# Altium schematic sheet 03_SHIELD_SLOT_A.SchDoc: Slot A for Lophilo Shield
size 381 x 266 mm; Organization: Meteroi; Address1: Room 428, 410 Guiping Rd.; Address2: Shanghai 200233, CHINA; SheetNumber: 3; SheetTotal: 9; PageSetup: Record=PageOptions|CenterHorizontal=True|CenterVertical=True|PrintScale=0.75|XCorrection=1.00|YCorrection=1.00|PrintKind=2|BorderSize=5000000|LeftOffset=0|BottomOffset=0|Orientation=2|PaperLength=1000|PaperWidth=1000|Scale=100|PaperSource=276|PrintQuality=-3|MediaType=1|DitherType=10|PaperKind=A4|PrintScaleMode=1
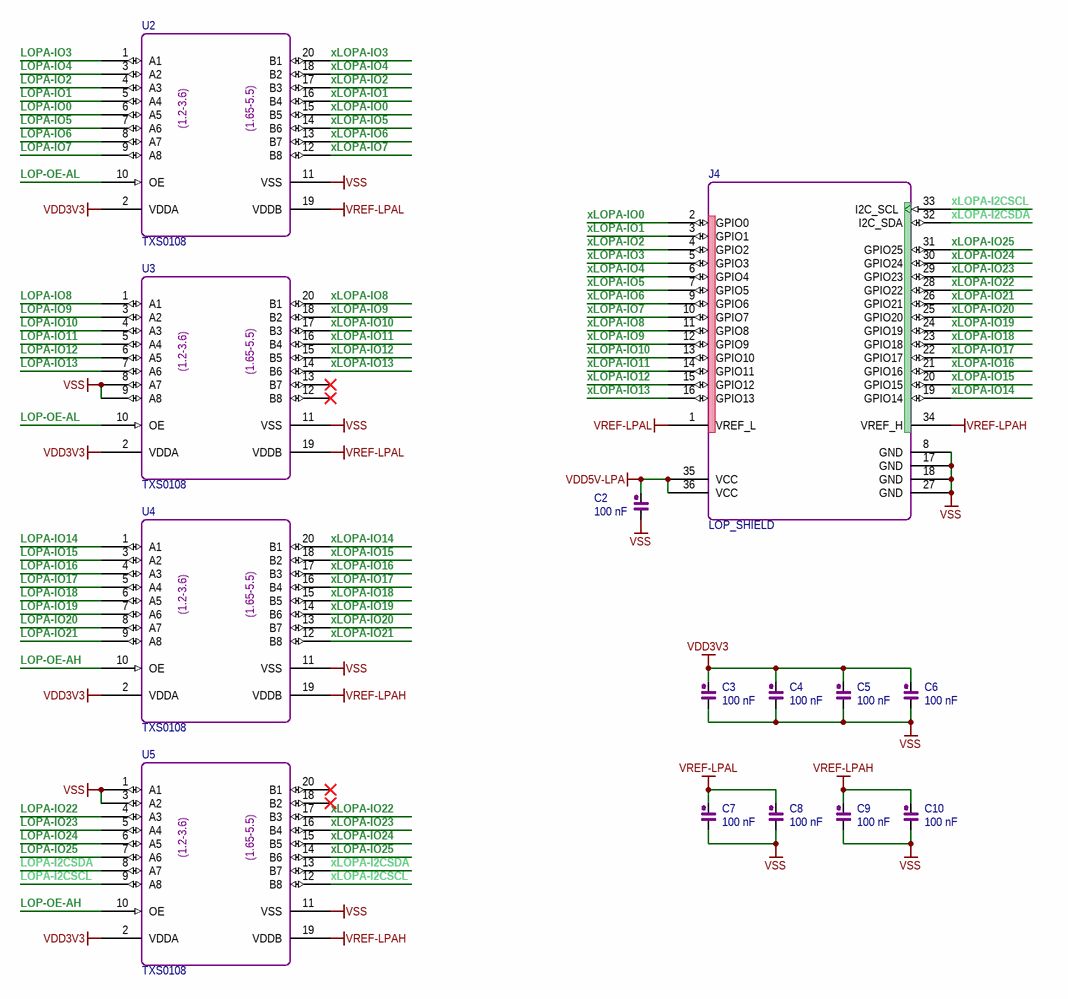
[diagram p0: 03_SHIELD_SLOT_A.SchDoc]

## Parts
C2  100 nF  [0603A1]
C3  100 nF  [0603A1]
C4  100 nF  [0603A1]
C5  100 nF  [0603A1]
C6  100 nF  [0603A1]
C7  100 nF  [0603A1]
C8  100 nF  [0603A1]
C9  100 nF  [0603A1]
C10  100 nF  [0603A1]
J4  LOP_SHIELD  [LOP_SHIELD]
U2  TXS0108  [TSSOP-20]
U3  TXS0108  [TSSOP-20]
U4  TXS0108  [TSSOP-20]
U5  TXS0108  [TSSOP-20]

## Nets
VDD3V3: C3.2 C4.2 C5.2 C6.2 U2.2(VDDA) U3.2(VDDA) U4.2(VDDA) U5.2(VDDA)
VDD5V-LPA: C2.2 J4.35(VCC) J4.36(VCC)
VREF-LPAH: C9.2 C10.2 J4.34(VREF_H) U4.19(VDDB) U5.19(VDDB)
VREF-LPAL: C7.2 C8.2 J4.1(VREF_L) U2.19(VDDB) U3.19(VDDB)
VSS: C2.1 C3.1 C4.1 C5.1 C6.1 C7.1 C8.1 C9.1 C10.1 J4.8(GND) J4.17(GND) J4.18(GND) J4.27(GND) U2.11(VSS) U3.8(A7) U3.9(A8) U3.11(VSS) U4.11(VSS) U5.1(A1) U5.3(A2) U5.11(VSS)
LOP-OE-AH: U4.10(OE) U5.10(OE)
LOP-OE-AL: U2.10(OE) U3.10(OE)
LOPA-I2CSCL: U5.9(A8)
LOPA-I2CSDA: U5.8(A7)
LOPA-IO0: U2.6(A5)
LOPA-IO1: U2.5(A4)
LOPA-IO2: U2.4(A3)
LOPA-IO3: U2.1(A1)
LOPA-IO4: U2.3(A2)
LOPA-IO5: U2.7(A6)
LOPA-IO6: U2.8(A7)
LOPA-IO7: U2.9(A8)
LOPA-IO8: U3.1(A1)
LOPA-IO9: U3.3(A2)
LOPA-IO10: U3.4(A3)
LOPA-IO11: U3.5(A4)
LOPA-IO12: U3.6(A5)
LOPA-IO13: U3.7(A6)
LOPA-IO14: U4.1(A1)
LOPA-IO15: U4.3(A2)
LOPA-IO16: U4.4(A3)
LOPA-IO17: U4.5(A4)
LOPA-IO18: U4.6(A5)
LOPA-IO19: U4.7(A6)
LOPA-IO20: U4.8(A7)
LOPA-IO21: U4.9(A8)
LOPA-IO22: U5.4(A3)
LOPA-IO23: U5.5(A4)
LOPA-IO24: U5.6(A5)
LOPA-IO25: U5.7(A6)
xLOPA-I2CSCL: J4.33(I2C_SCL) U5.12(B8)
xLOPA-I2CSDA: J4.32(I2C_SDA) U5.13(B7)
xLOPA-IO0: J4.2(GPIO0) U2.15(B5)
xLOPA-IO1: J4.3(GPIO1) U2.16(B4)
xLOPA-IO2: J4.4(GPIO2) U2.17(B3)
xLOPA-IO3: J4.5(GPIO3) U2.20(B1)
xLOPA-IO4: J4.6(GPIO4) U2.18(B2)
xLOPA-IO5: J4.7(GPIO5) U2.14(B6)
xLOPA-IO6: J4.9(GPIO6) U2.13(B7)
xLOPA-IO7: J4.10(GPIO7) U2.12(B8)
xLOPA-IO8: J4.11(GPIO8) U3.20(B1)
xLOPA-IO9: J4.12(GPIO9) U3.18(B2)
xLOPA-IO10: J4.13(GPIO10) U3.17(B3)
xLOPA-IO11: J4.14(GPIO11) U3.16(B4)
xLOPA-IO12: J4.15(GPIO12) U3.15(B5)
xLOPA-IO13: J4.16(GPIO13) U3.14(B6)
xLOPA-IO14: J4.19(GPIO14) U4.20(B1)
xLOPA-IO15: J4.20(GPIO15) U4.18(B2)
xLOPA-IO16: J4.21(GPIO16) U4.17(B3)
xLOPA-IO17: J4.22(GPIO17) U4.16(B4)
xLOPA-IO18: J4.23(GPIO18) U4.15(B5)
xLOPA-IO19: J4.24(GPIO19) U4.14(B6)
xLOPA-IO20: J4.25(GPIO20) U4.13(B7)
xLOPA-IO21: J4.26(GPIO21) U4.12(B8)
xLOPA-IO22: J4.28(GPIO22) U5.17(B3)
xLOPA-IO23: J4.29(GPIO23) U5.16(B4)
xLOPA-IO24: J4.30(GPIO24) U5.15(B5)
xLOPA-IO25: J4.31(GPIO25) U5.14(B6)

Not connected (* = marked no-connect by the designer): U3 12(B8)* 13(B7)*; U5 18(B2)* 20(B1)*

## Notes on the sheet
- Title:
- Project:
- Sheet:
- Of
- Size:
- D/N:
- Rev:
- Date:
- P/N:
- S/N:
- Designer:
- C
- (in symbol TXS0108) (1.2-3.6); (1.65-5.5)

## Library data of the parts
C2-C10 = CAP: Normal Capacitor; PartNumber: 0; Vendor: muRata; Designer: shyul; PinCountSMD: 2; Value: 100 nF; SerialNumber: 0; Publisher: Cowin; PCBMarker: Capacitor; Version: 1.0; VersionDate: 04-27-2011; PinCountHole: 0
J4 = LOP_SHIELD: Lophilo Shield Module Slot; Vendor: 0; PinCountHole: 36; Designer: shyul; Value: LOP_SHIELD; PartNumber: LOP_SHIELD; Version: 1.0; VersionDate: 03-19-2012; PinCountSMD: 0; SerialNumber: 0; Publisher: Cowin; PCBMarker: LOP_SHIELD
U2-U5 = TXS0108: 8-bit Translator; Vendor: TI; Designer: shyul; PinCountSMD: 20; PinCountHole: 0; PCBMarker: 8-bit Translator; PartNumber: TXS0108; Value: TXS0108; Version: 1.0; VersionDate: 05-23-2011; Publisher: Cowin; SerialNumber: 0